# Altium schematic sheet PushButtondirection.SchDoc
size B; DocumentNumber: 6; SheetNumber: 6; SheetTotal: 6
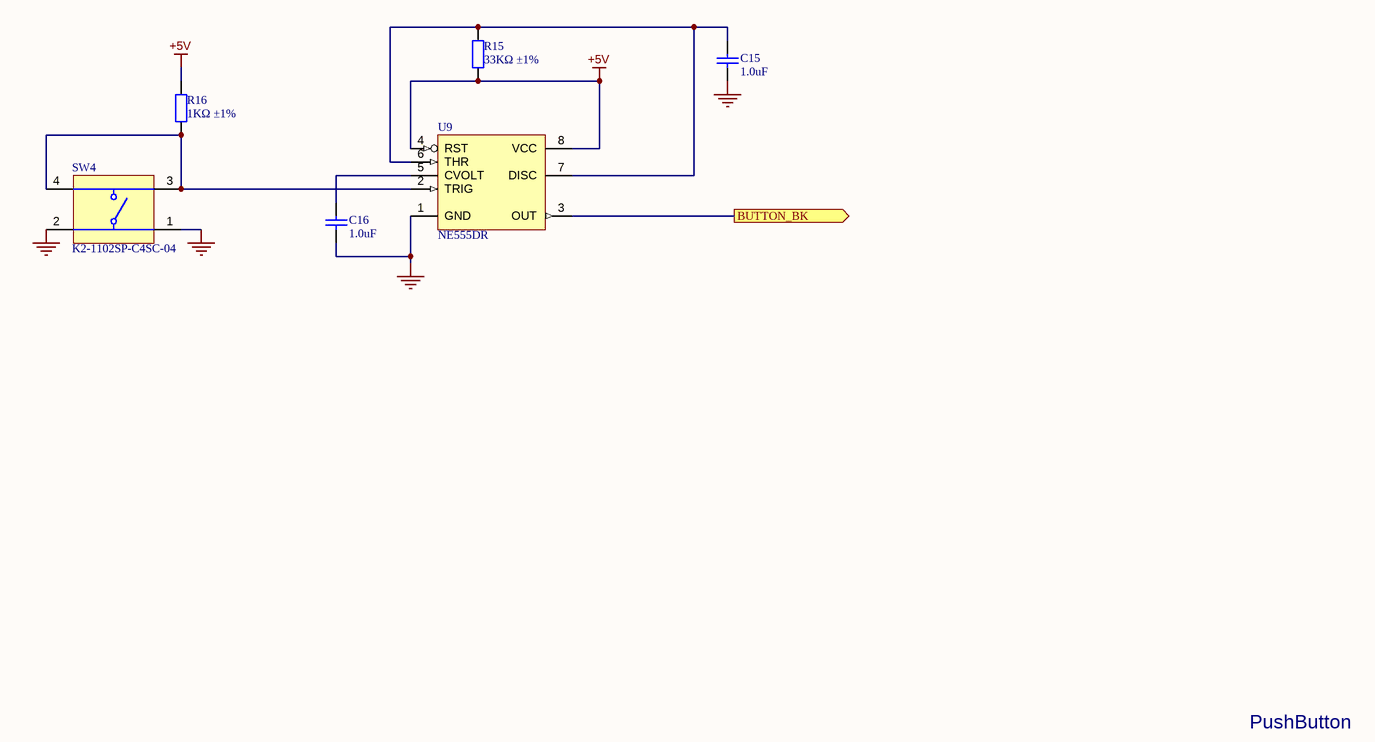
[diagram p0: PushButtondirection.SchDoc]

## Parts
C15  1.0uF  [0402_C]
C16  1.0uF  [0402_C]
R15  33KΩ ±1%  [0402_R]
R16  1KΩ ±1%  [0402_R]
SW4  K2-1102SP-C4SC-04  [TECO-FSM4JSMATR_V]
U9  NE555DR  [SOIC-8_150mil]

## Ports
BUTTON_BK (out)

## Nets
+5V: R15.1 R16.1 U9.4(RST) U9.8(VCC)
GND: C15.1 C16.2 SW4.1 SW4.2 U9.1(GND)
BUTTON_BK: U9.3(OUT) ; port BUTTON_BK
NetC15_2: C15.2 R15.2 U9.6(THR) U9.7(DISC)
NetC16_1: C16.1 U9.5(CVOLT)
NetR16_2: R16.2 SW4.3 SW4.4 U9.2(TRIG)

## Notes on the sheet
- PushButton
- SHEET
- Expatria Technologies
- 1136 Glade Court
- Port Coquitlam, BC V3B 1R5
- PROJECT
- SIZE
- ENGR
- MODIFIED
- DOCUMENT
- REV
- Copyright Expatria Technologies 2021.  This document describes Open Hardware and is licensed under the CERN-OHL-P  v2.  No warranty is implied or expressed.
- EMAIL: INFO@EXPATRIA.CA
- B
- /

## Library data of the parts
C15 C16 = 0402 1.0uF (105) 10% 25V: Chip capacitor; Manufacturer: Samsung Electro-Mechanics; PartNumber: CL05A105KA5NQNC; Capacitance: 1uF; Tolerance: 10%; Voltage: 25V; ComponentLink1Description: Supplier link; ComponentLink1URL: http://www.szlcsc.com/product/details_53938.html; Package: 0402; Supplier: LC; SuppliersPartNumber: C52923
R15 = 0402 33K (3302) 1%: Chip resistor; Manufacturer: Uniroyal Elec; PartNumber: 0402WGF3302TCE; Power: 1/16W; ComponentLink1Description: Supplier link; ComponentLink1URL: http://www.szlcsc.com/product/details_26522.html; Package: 0402; Supplier: LC; SuppliersPartNumber: C25779; Resistance: 33KΩ; Tolerance: 1%
R16 = 0402 1K (1001) 1%: Chip resistor; Manufacturer: Uniroyal Elec; PartNumber: 0402WGF1001TCE; Power: 1/16W; ComponentLink1Description: Supplier link; ComponentLink1URL: http://www.szlcsc.com/product/details_12256.html; Package: 0402; Supplier: LC; SuppliersPartNumber: C11702; Resistance: 1KΩ; Tolerance: 1%
SW4 = CMP-2000-07486-1: Top Actuated 50mA @ 12VDC Round Button SPST 6*6mm Tactile Switches ROHS; SuppliersPartNumber: C127509; Package: SMD-4_6.0x6.0x4.5P
U9 = NE555DR_[C7593]: 时基集成; ComponentLink1Description: 供应商链接; ComponentLink1URL: http://www.szlcsc.com/product/details_8070.html; Package: SOIC-8_150mil; Supplier: LC; SuppliersPartNumber: C7593